# EAGLE design adf4350-breakout (EAGLE 5.11)
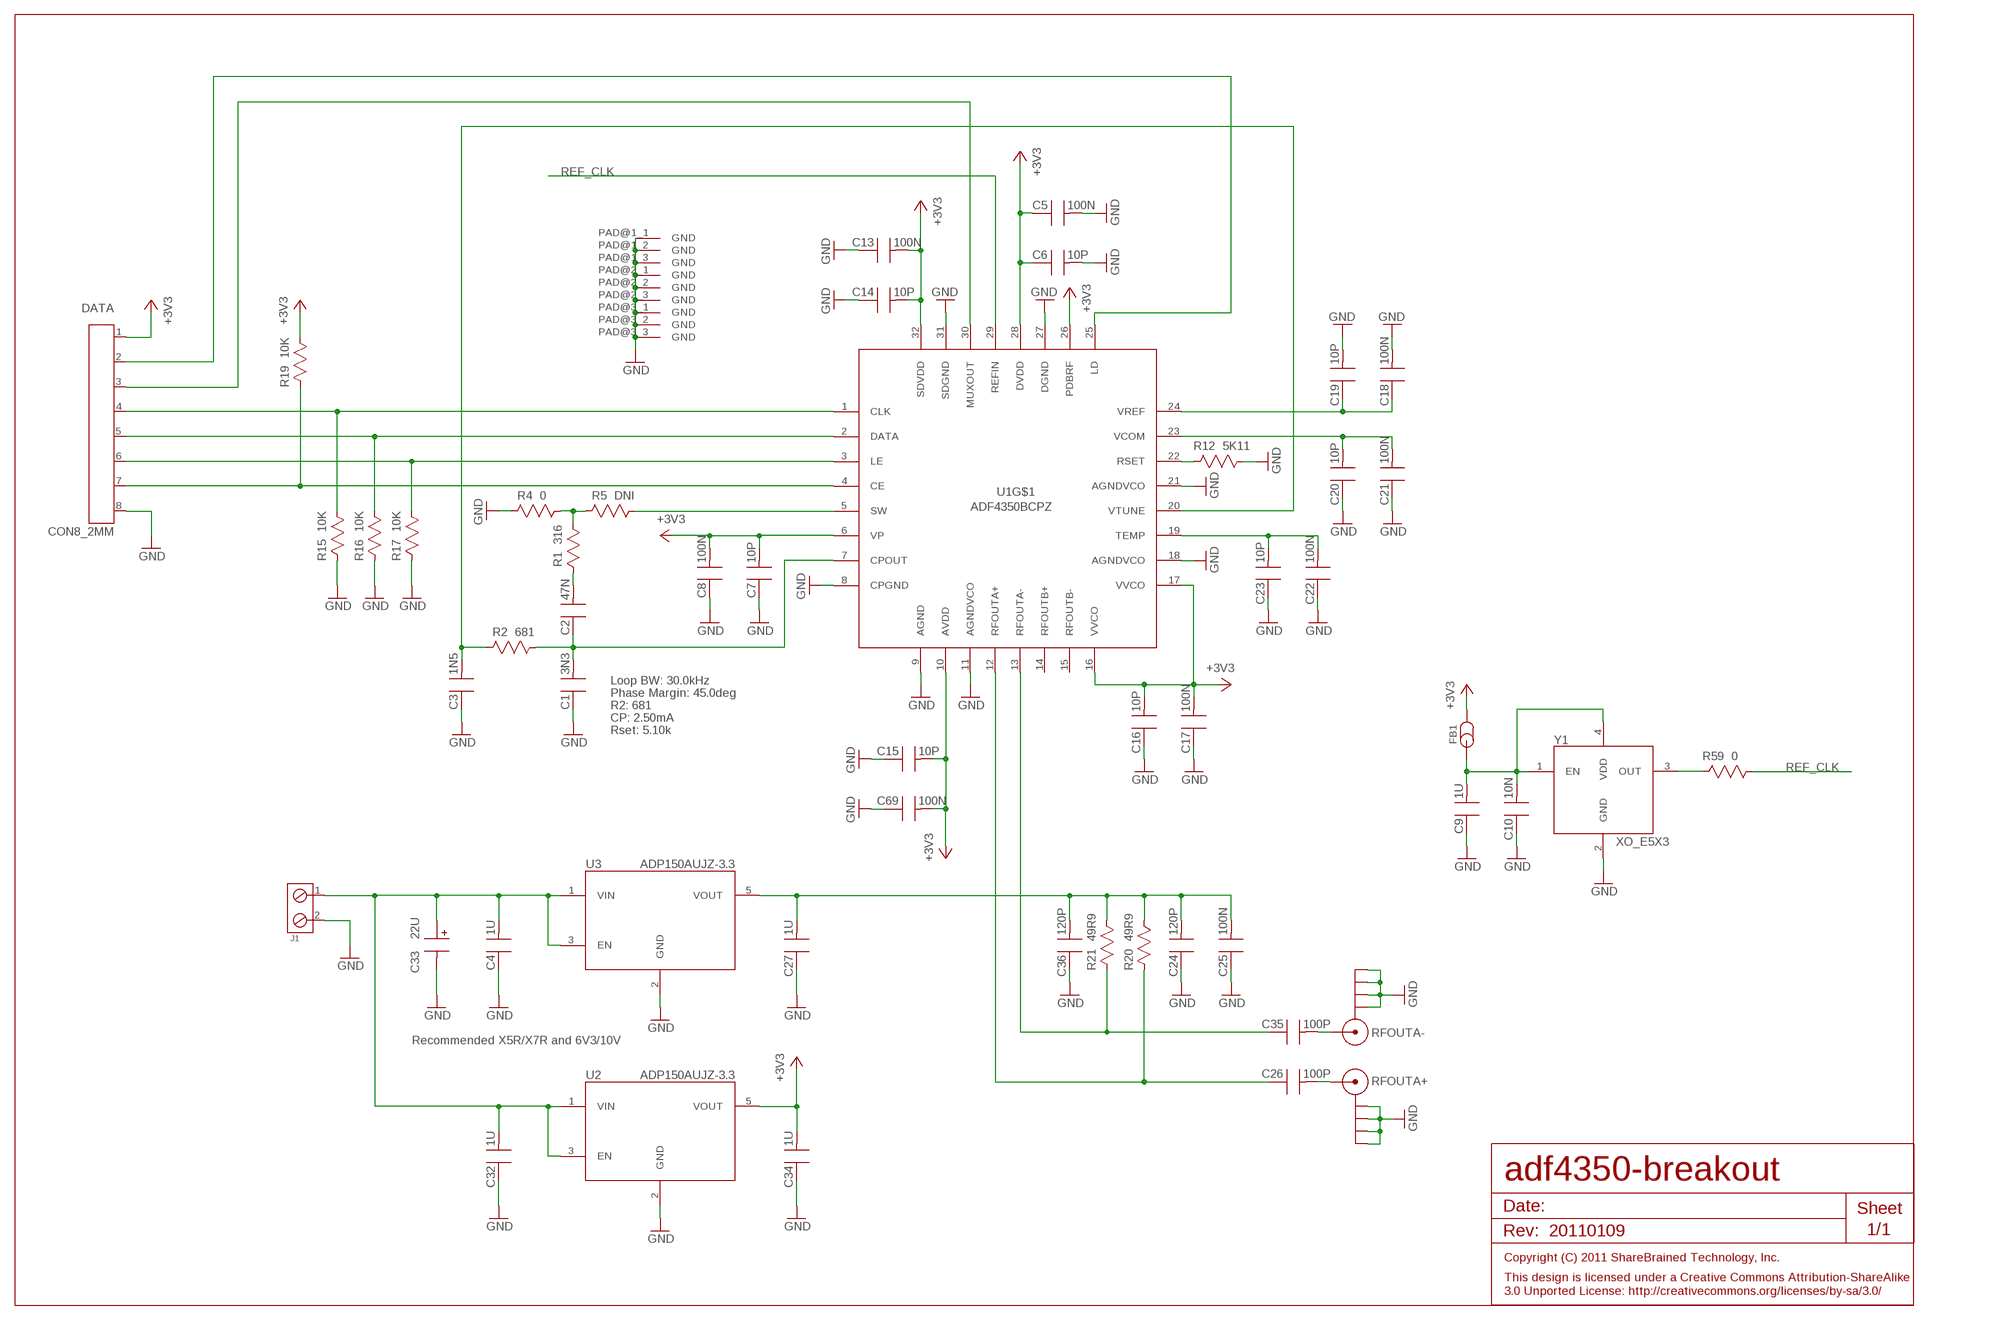
[diagram p0: schematic, sheet 1]

## Parts
C1  3N3  C0603_90  [CAPC1608X90N]
C2  47N  C0603_90  [CAPC1608X90N]
C3  1N5  C0603_90  [CAPC1608X90N]
C4  1U  C0603_90  [CAPC1608X90N]
C5  100N  C0402_55  [CAPC1005X55N]
C6  10P  C0402_55  [CAPC1005X55N]
C7  10P  C0402_55  [CAPC1005X55N]
C8  100N  C0402_55  [CAPC1005X55N]
C9  1U  C0603_90  [CAPC1608X90N]
C10  10N  C0402_55  [CAPC1005X55N]
C13  100N  C0402_55  [CAPC1005X55N]
C14  10P  C0402_55  [CAPC1005X55N]
C15  10P  C0402_55  [CAPC1005X55N]
C16  10P  C0402_55  [CAPC1005X55N]
C17  100N  C0402_55  [CAPC1005X55N]
C18  100N  C0402_55  [CAPC1005X55N]
C19  10P  C0402_55  [CAPC1005X55N]
C20  10P  C0402_55  [CAPC1005X55N]
C21  100N  C0402_55  [CAPC1005X55N]
C22  100N  C0402_55  [CAPC1005X55N]
C23  10P  C0402_55  [CAPC1005X55N]
C24  120P  C0402_55  [CAPC1005X55N]
C25  100N  C0402_55  [CAPC1005X55N]
C26  100P  C0402_55  [CAPC1005X55N]
C27  1U  C0603_90  [CAPC1608X90N]
C32  1U  C0603_90  [CAPC1608X90N]
C33  22U  CPOL7343-43  [CAPMP7343X430N]
C34  1U  C0603_90  [CAPC1608X90N]
C35  100P  C0402_55  [CAPC1005X55N]
C36  120P  C0402_55  [CAPC1005X55N]
C69  100N  C0402_55  [CAPC1005X55N]
DATA  CON8_2MM  [STAKE_2MM_8]
FB1  FB0603  [INDC1608X95N]
J1  TERMINAL2_ED100_DS_2POS  [2POS_5MM_STACKING]
R1  316  R0603_55  [RESC1608X55N]
R2  681  R0603_55  [RESC1608X55N]
R4  0  R0603_55  [RESC1608X55N]
R5  DNI  R0603_55  [RESC1608X55N]
R12  5K11  R0603_55  [RESC1608X55N]
R15  10K  R0603_55  [RESC1608X55N]
R16  10K  R0603_55  [RESC1608X55N]
R17  10K  R0603_55  [RESC1608X55N]
R19  10K  R0603_55  [RESC1608X55N]
R20  49R9  R0402_40  [RESC1005X40N]
R21  49R9  R0402_40  [RESC1005X40N]
R59  0  R0603_55  [RESC1608X55N]
RFOUTA+  SMA142-0701-801  [142-0701-801]
RFOUTA-  SMA142-0701-801  [142-0701-801]
U1  ADF4350BCPZ  [QFN50P500X500X100-33V2N]
U2  ADP150AUJZ-3.3  [SOT95P280X110-5N]
U3  ADP150AUJZ-3.3  [SOT95P280X110-5N]
Y1  XO_E5X3  [OSCSC254P320X500X120-4N]

## Nets
+3V3: C5.1 C6.1 C7.2 C8.2 C13.2 C14.2 C15.2 C16.2 C17.2 C34.2 C69.2 DATA.1 FB1.2 R19.2 U1.6(VP) U1.10(AVDD) U1.16(VVCO) U1.17(VVCO) U1.26(PDBRF) U1.28(DVDD) U1.32(SDVDD) U2.5(VOUT)
GND: C1.1 C3.1 C4.1 C5.2 C6.2 C7.1 C8.1 C9.1 C10.1 C13.1 C14.1 C15.1 C16.1 C17.1 C18.2 C19.2 C20.1 C21.1 C22.1 C23.1 C24.1 C25.1 C27.1 C32.1 C33.2 C34.1 C36.1 C69.1 DATA.8 J1.2 R4.1 R12.2 R15.1 R16.1 R17.1 RFOUTA+.RING@1(RING) RFOUTA+.RING@2(RING) RFOUTA+.RING@3(RING) RFOUTA+.RING@4(RING) RFOUTA-.RING@1(RING) RFOUTA-.RING@2(RING) RFOUTA-.RING@3(RING) RFOUTA-.RING@4(RING) U1.8(CPGND) U1.9(AGND) U1.11(AGNDVCO) U1.18(AGNDVCO) U1.21(AGNDVCO) U1.27(DGND) U1.31(SDGND) U1.PAD@1_1(GND) U1.PAD@1_2(GND) U1.PAD@1_3(GND) U1.PAD@2_1(GND) U1.PAD@2_2(GND) U1.PAD@2_3(GND) U1.PAD@3_1(GND) U1.PAD@3_2(GND) U1.PAD@3_3(GND) U2.2(GND) U3.2(GND) Y1.2(GND)
N$1: DATA.2 U1.25(LD)
N$5: R59.1 Y1.3(OUT)
N$6: C9.2 C10.2 FB1.1 Y1.1(EN) Y1.4(VDD)
N$7: DATA.4 R15.2 U1.1(CLK)
N$8: DATA.5 R16.2 U1.2(DATA)
N$9: DATA.6 R17.2 U1.3(LE)
N$10: C22.2 C23.2 U1.19(TEMP)
N$11: C20.2 C21.2 U1.23(VCOM)
N$12: DATA.7 R19.1 U1.4(CE)
N$14: C18.1 C19.1 U1.24(VREF)
N$15: R12.1 U1.22(RSET)
N$16: C26.1 R20.1 U1.12(RFOUTA+)
N$17: C35.1 R21.1 U1.13(RFOUTA-)
N$20: C24.2 C25.2 C27.2 C36.2 R20.2 R21.2 U3.5(VOUT)
N$22: C4.2 C32.2 C33.1 J1.1 U2.1(VIN) U2.3(EN) U3.1(VIN) U3.3(EN)
N$23 [50ohm]: C35.2 RFOUTA-.TIP
N$24 [50ohm]: C26.2 RFOUTA+.TIP
N$25: C1.2 C2.1 R2.2 U1.7(CPOUT)
N$26: C3.2 R2.1 U1.20(VTUNE)
N$27: C2.2 R1.1
N$28: R1.2 R4.2 R5.1
N$29: R5.2 U1.5(SW)
N$30: DATA.3 U1.30(MUXOUT)
REF_CLK: R59.2 U1.29(REFIN)
Unconnected: U1.14(RFOUTB+) U1.15(RFOUTB-)

## Notes on the sheet
- Loop BW: 30.0kHz
- Phase Margin: 45.0deg
- R2: 681
- CP: 2.50mA
- Rset: 5.10k
- Recommended X5R/X7R and 6V3/10V
- 20110109

## Library data of the parts
C1-C10 C13-C27 C32 C34-C36 C69 = capacitor:C
C33 = capacitor:CPOL
DATA = stake:CON8
FB1 = inductor:FB
J1 = terminal_blocks:TERMINAL2
R1 R2 R4 R5 R12 R15-R17 R19-R21 R59 = resistor:R
RFOUTA+ RFOUTA- = sma:SMA
U1 = analog_devices:ADF4350
U2 U3 = analog_devices:ADP150A?-*
Y1 = oscillator:XO_E

## Net classes
1 50ohm: width 0.508 mm, clearance 0.762 mm

## Board
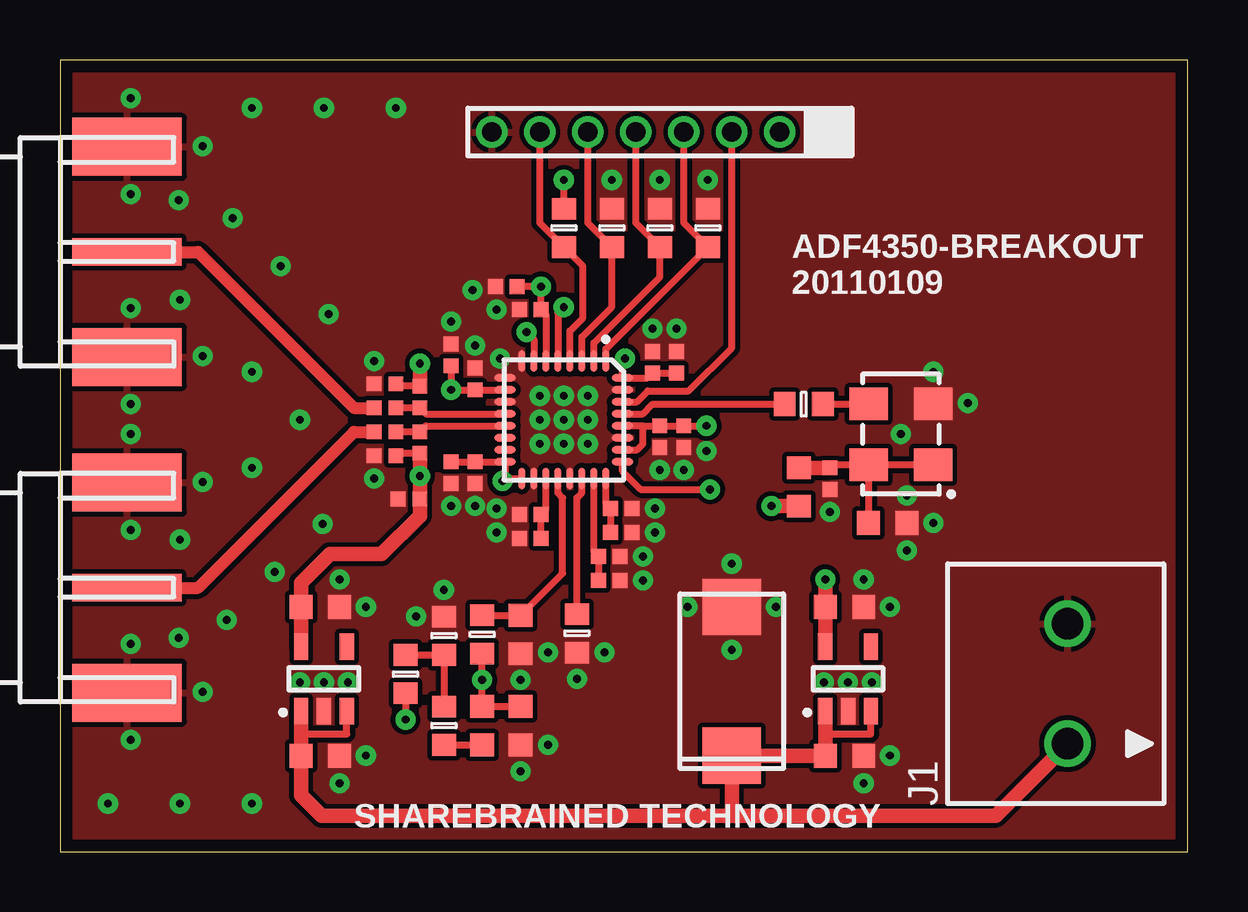
[diagram p1: board, top side]
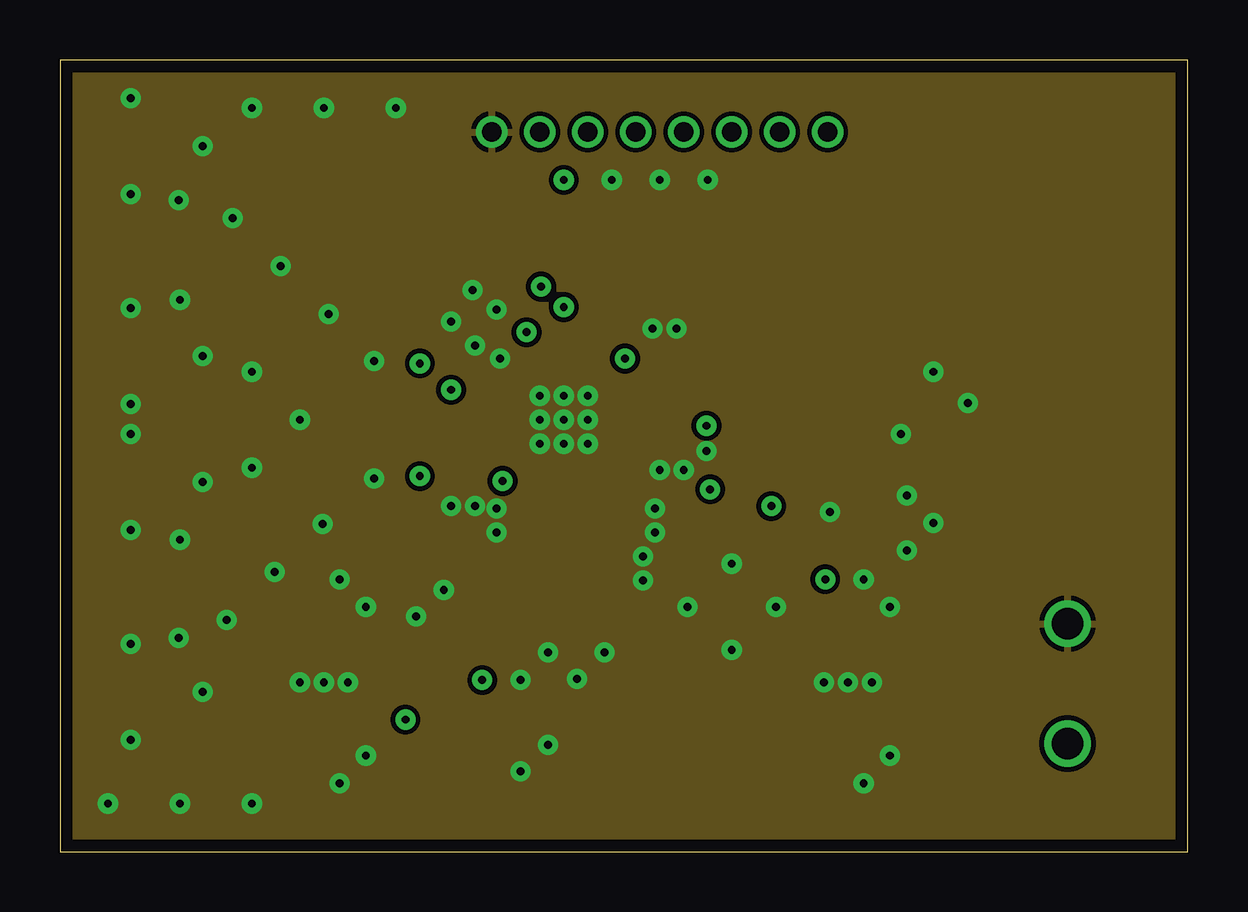
[diagram p2: board, inner layer Route2]
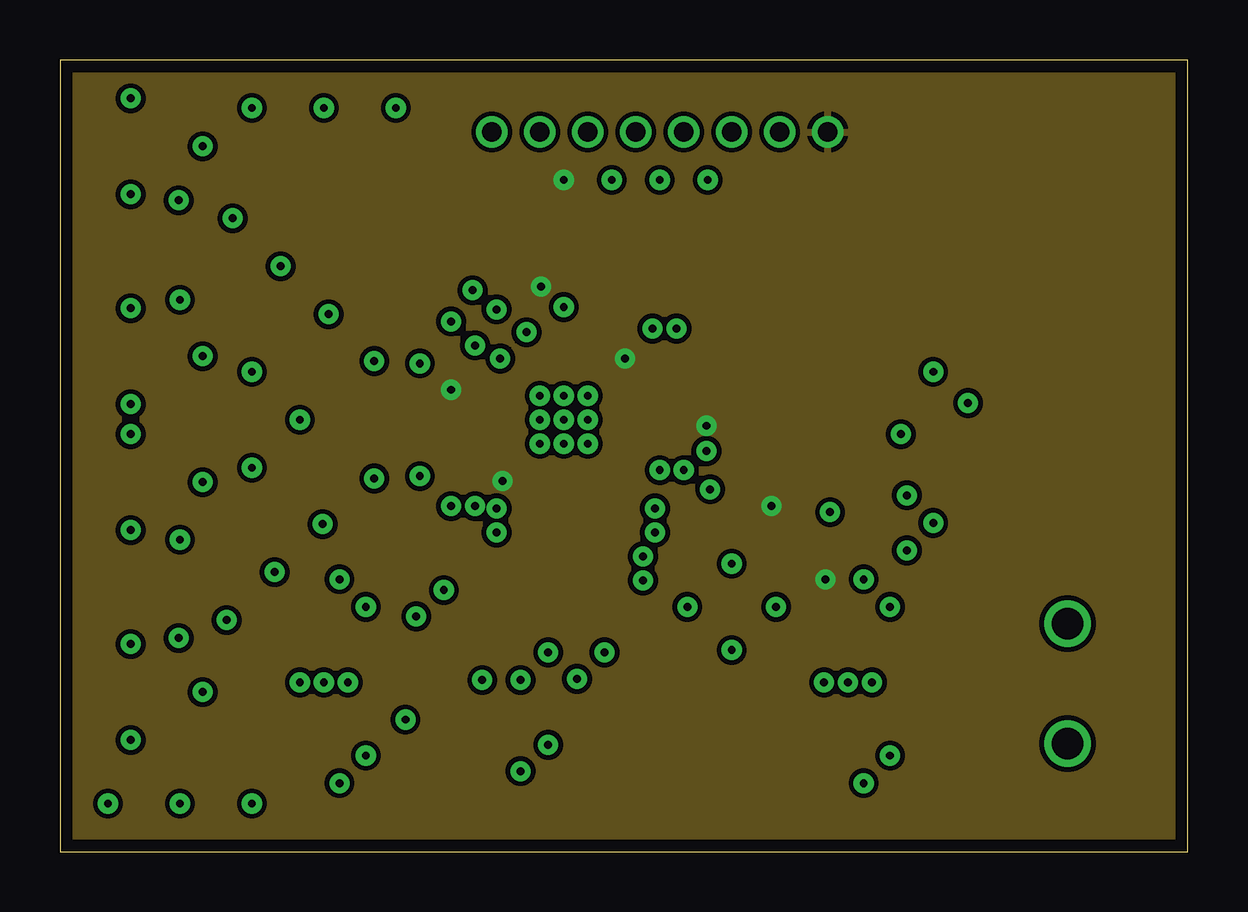
[diagram p3: board, inner layer Route15]
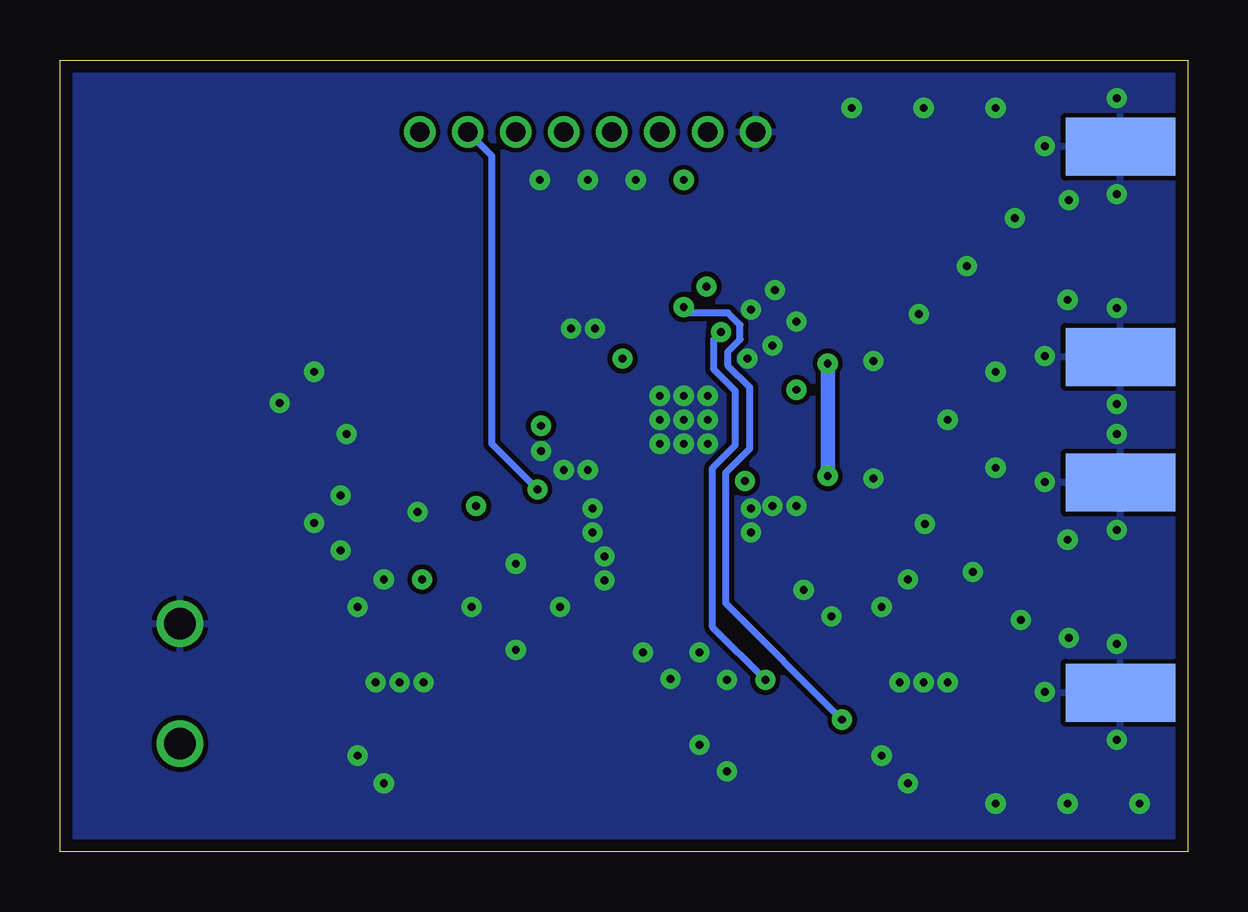
[diagram p4: board, bottom side, seen from below]

Size 47 x 33 mm. Coordinates in mm from the lower left corner, seen from the top.
Outline: 0,0 47,0 47,33 0,33 0,0
Copper layers (1+2*15+16): Top 0.0178mm / dielectric 0.3048mm / Route2 0.0356mm / dielectric 0.7112mm / Route15 0.0356mm / dielectric 0.3048mm / Bottom 0.0178mm
Design rules "adf4350-breakout *": minimum track width 0.3mm, minimum drill 13mil, track to track 0.2mm, track to pad 0.2mm, pad to pad 0.2mm, via to via 0.2mm, smd to smd 0.2mm, copper to edge 20mil, drill to drill 16mil, minimum pad ring 10mil, minimum via ring 10mil, stop-mask expansion 3mil, vias tented up to drill 13mil, thermal gap 8mil

### Footprints (pad centres in the part's own frame; a part is rotated, then mirrored left to right if it is on the bottom)
CAPC1608X90N = smd 0.95 x 1: 1 -0.8,0; 2 0.8,0
CAPC1005X55N = smd 0.62 x 0.62: 1 -0.45,0; 2 0.45,0
CAPMP7343X430N = smd 2.35 x 2.45: 1 -3.1,0; 2 3.1,0
STAKE_2MM_8 = drill 0.8 round: 1 0,7; 2 0,5; 3 0,3; 4 0,1; 5 0,-1; 6 0,-3; 7 0,-5; 8 0,-7
INDC1608X95N = smd 0.95 x 1: 1 -0.8,0; 2 0.8,0
2POS_5MM_STACKING = drill 1.3 round: 1 -2.5,0; 2 2.5,0
RESC1608X55N = smd 0.9 x 1: 1 -0.8,0; 2 0.8,0
RESC1005X40N = smd 0.6 x 0.6: 1 -0.45,0; 2 0.45,0
142-0701-801 = smd 2.413 x 4.572: RING@1 -4.381,-2.794; RING@2 4.381,-2.794 | smd 2.413 x 4.572 bottom: RING@3 -4.381,-2.794; RING@4 4.381,-2.794 | smd 1.143 x 4.572: TIP 0,-2.794
QFN50P500X500X100-33V2N = smd 0.9 x 0.3: 1 -2.45,1.75; 2 -2.45,1.25; 3 -2.45,0.75; 4 -2.45,0.25; 5 -2.45,-0.25; 6 -2.45,-0.75; 7 -2.45,-1.25; 8 -2.45,-1.75; 17 2.45,-1.75; 18 2.45,-1.25; 19 2.45,-0.75; 20 2.45,-0.25; 21 2.45,0.25; 22 2.45,0.75; 23 2.45,1.25; 24 2.45,1.75 | smd 0.3 x 0.9: 9 -1.75,-2.45; 10 -1.25,-2.45; 11 -0.75,-2.45; 12 -0.25,-2.45; 13 0.25,-2.45; 14 0.75,-2.45; 15 1.25,-2.45; 16 1.75,-2.45; 25 1.75,2.45; 26 1.25,2.45; 27 0.75,2.45; 28 0.25,2.45; 29 -0.25,2.45; 30 -0.75,2.45; 31 -1.25,2.45; 32 -1.75,2.45 | drill 0.33 round: PAD@1_1 -1,1; PAD@1_2 -1,0; PAD@1_3 -1,-1; PAD@2_1 0,1; PAD@2_2 0,0; PAD@2_3 0,-1; PAD@3_1 1,1; PAD@3_2 1,0; PAD@3_3 1,-1
SOT95P280X110-5N = smd 1.1 x 0.6: 1 -1.35,0.95; 2 -1.35,0; 3 -1.35,-0.95; 4 1.35,-0.95; 5 1.35,0.95
OSCSC254P320X500X120-4N = smd 1.6 x 1.35: 1 -1.35,1.27; 2 -1.35,-1.27; 3 1.35,-1.27; 4 1.35,1.27

### Placement (x,y rotation side)
C1  19.2,5.25 90 top
C2  17.6,5.25 270 top
C3  19.2,9.05 90 top
C4  10.85,4 180 top
C5  26,17.3 270 top
C6  25,17.3 270 top
C7  19.6,22.6 0 top
C8  18.6,23.55 0 top
C9  34.5,13.7 180 top
C10  32.1,15.55 90 top
C13  25.7,20.4 270 top
C14  24.7,20.4 270 top
C15  17.3,19.7 270 top
C16  17.3,15.8 90 top
C17  16.3,15.8 90 top
C18  23.4,13.3 0 top
C19  23.4,14.3 0 top
C20  22.9,12.3 180 top
C21  22.9,11.3 180 top
C22  19.6,13.05 0 top
C23  19.6,14.05 0 top
C24  13.55,16.5 0 top
C25  14.55,14.7 0 top
C26  13.55,18.5 180 top
C27  10.85,10.2 180 top
C32  32.7,4 180 top
C33  28,7.1 90 top
C34  32.7,10.2 180 top
C35  13.55,17.5 180 top
C36  13.55,19.5 0 top
C69  16.3,20.7 270 top
DATA  25,30 270 top
FB1  30.8,15.2 270 top
J1  42,7 90 top
R1  16,5.25 90 top
R2  17.6,9.05 270 top
R4  16,9 270 top
R5  14.4,7.4 270 top
R12  21.55,9.1 270 top
R15  27,26 270 top
R16  25,26 270 top
R17  23,26 270 top
R19  21,26 90 top
R20  15,18.95 90 top
R21  15,17.05 270 top
R59  31,18.65 180 top
RFOUTA+  0,25 90 top
RFOUTA-  0,11 90 top
U1  21,18 270 top
U2  32.85,7.2 90 top
U3  11,7.2 90 top
Y1  35.05,17.4 180 top

### Tracks (layer width: path | path; a pad name or v marks a point on that pad's centre or on a via)
+3V3  (via drill 0.33)
  Top 0.3: U1.26 24.05,16.75 24.3,17 24.3,17.75 | 24.3,17.75 C6.1 C5.1 v26.95,17.75 | 24.3,17.75 U1.28 | C17.2 C16.2 U1.16 18.55,15.55 | 18.55,15.55 U1.17 | 18.55,15.55 v18.45,15.45 | v23.55,20.55 23.45,20.45 U1.32 24.5,19.75 C14.2 C13.2 | U1.10 C15.2 v16.3,19.25 C69.2 | C8.2 v20.05,23.55 C7.2 20.25,22.4 U1.6 | R19.2 v21,28
  Top 0.6: v29.65,14.4 FB1.2 | U2.5 C34.2 v31.9,11.35
  pour Route15: 0,0 0,33 47,33 47,0
GND  (via drill 0.33)
  other vias: 16.3,22.1 17.3,21.1 18.35,20.55 13.1,20.45 13.1,15.55 16.3,14.4 17.3,14.4 18.2,14.3 18.2,13.3 24.8,14.3 24.8,13.3 24.3,12.3 24.3,11.3 25,15.9 26,15.9 24.7,21.8 25.7,21.8 22.7,8.3 21.55,7.2 20.35,8.3 16,10.9 14.85,9.8 20.35,4.45 19.2,3.35 35.3,14.85 36.4,13.7 35.3,12.55 32.1,14.15 35.05,17.4 37.85,18.7 36.4,20 26.95,16.7 18.2,22.6 17.2,23.4 19.2,7.15 32.85,7.05 34.6,4 33.5,2.85 33.5,11.35 34.6,10.2 28,8.4 29.85,10.2 26.15,10.2 28,12 31.85,7.05 33.85,7.05 11,7.05 10,7.05 12,7.05 11.65,11.35 11.65,2.85 12.75,4 12.75,10.2 23,28 25,28 27,28 11.2,22.4 9.2,24.4 7.2,26.4 2.95,27.4 5.95,29.4 2.95,31.4 2.95,18.65 2.95,22.65 5.95,20.65 2.95,17.4 5.95,15.4 2.95,13.4 2.95,8.65 5.95,6.65 2.95,4.65 4.95,27.15 10,18 8,20 8,16 5,23 5,13 10.95,13.65 8.95,11.65 6.95,9.65 4.95,8.9 8,31 11,31 14,31 2,2 5,2 8,2
  pour Route2: 0,0 0,33 47,33 47,0
  pour Top: 0,0 0,33 47,33 47,0
  pour Bottom: 0,0 0,33 47,33 47,0
N$1  (via drill 0.33)
  Top 0.3: U1.25 23.45,15.85 24.2,15.1 v27.1,15.1
  Bottom 0.3: v27.1,15.1 29,17 29,29 DATA.2
N$5
  Top 0.3: R59.1 33.68,18.65 Y1.3
N$6
  Top 0.3: Y1.4 Y1.1 | Y1.4 32.23,16.13 C10.2 | Y1.4 C9.2
  Top 0.6: FB1.1 C10.2
N$7
  Top 0.3: DATA.4 26,26.2 R15.2 22.75,20.95 U1.1
N$8
  Top 0.3: U1.2 22.25,21.2 25,23.95 R16.2 24,26.2 DATA.5
N$9
  Top 0.3: U1.3 21.75,21.45 23,22.7 R17.2 22,26.2 DATA.6
N$10
  Top 0.3: U1.19 20.25,14.25 C23.2 C22.2
N$11
  Top 0.3: U1.23 22.25,12.5 C20.2 C21.2
N$12
  Top 0.3: U1.4 21.25,21.7 21.8,22.25 21.8,24.4 R19.1 20,26.2 DATA.7
N$14
  Top 0.3: U1.24 22.75,14.5 C19.1 C18.1
N$15
  Top 0.3: R12.1 21.55,14.75 21.75,14.95 U1.22
N$16
  Top 0.3: U1.12 15.25,18.25 R20.1 | R20.1 14.95,18.5 | R20.1 C26.1
N$17
  Top 0.3: U1.13 15.25,17.75 R21.1 C35.1
N$20  (via drill 0.33)
  Top 0.3: R20.2 14.1,19.4 C36.2 | R21.2 14.1,16.6 C24.2
  Top 0.6: v15,20.35 R20.2 | R21.2 v15,15.65 C25.2 15,14 13.4,12.4 11.25,12.4 10.05,11.2 C27.2 U3.5
  Bottom 0.6: v15,15.65 v15,20.35
N$22
  Top 0.3: U2.3 33.8,4.9 31.9,4.9 | U3.3 11.95,4.9 10.05,4.9
  Top 0.6: U2.1 31.9,4.9 C32.2 C33.1 28,1.5 | U3.1 10.05,4.9 C4.2 10.05,2.35 10.9,1.5 28,1.5 | 28,1.5 39,1.5 J1.1
N$23
  Top 0.508: RFOUTA-.TIP 5.75,11 12.25,17.5 C35.2
N$24
  Top 0.508: RFOUTA+.TIP 5.75,25 12.25,18.5 C26.2
N$25  (via drill 0.33)
  Top 0.3: C1.2 C2.1 v17.6,7.15 R2.2 | U1.7 19.75,21.35 v19.45,21.65
  Bottom 0.3: v19.45,21.65 19.75,21.35 19.75,20.1 18.85,19.2 18.85,16.95 19.8,16 19.8,9.35 v17.6,7.15
N$26
  Top 0.3: U1.20 20.75,14.95 20.95,14.75 20.95,11.6 C3.2 R2.1
N$27
  Top 0.3: R1.1 C2.2
N$28
  Top 0.3: R1.2 R4.2 R5.1
N$29  (via drill 0.33)
  Top 0.3: U1.5 20.75,22.45 v21,22.7 | R5.2 v14.4,5.5
  Bottom 0.3: v21,22.7 20.75,22.45 19.15,22.45 18.65,21.95 18.65,21.35 19.15,20.85 19.15,20.25 18.25,19.35 18.25,16.8 19.25,15.8 19.25,10.35 v14.4,5.5
N$30
  Top 0.3: U1.30 24.05,18.75 24.5,19.2 26.2,19.2 28,21 DATA.3
REF_CLK
  Top 0.3: U1.29 24.3,18.25 24.7,18.65 R59.2

### Text on the board
tPlace: ADF4350-BREAKOUT | 20110109 | SHAREBRAINED TECHNOLOGY